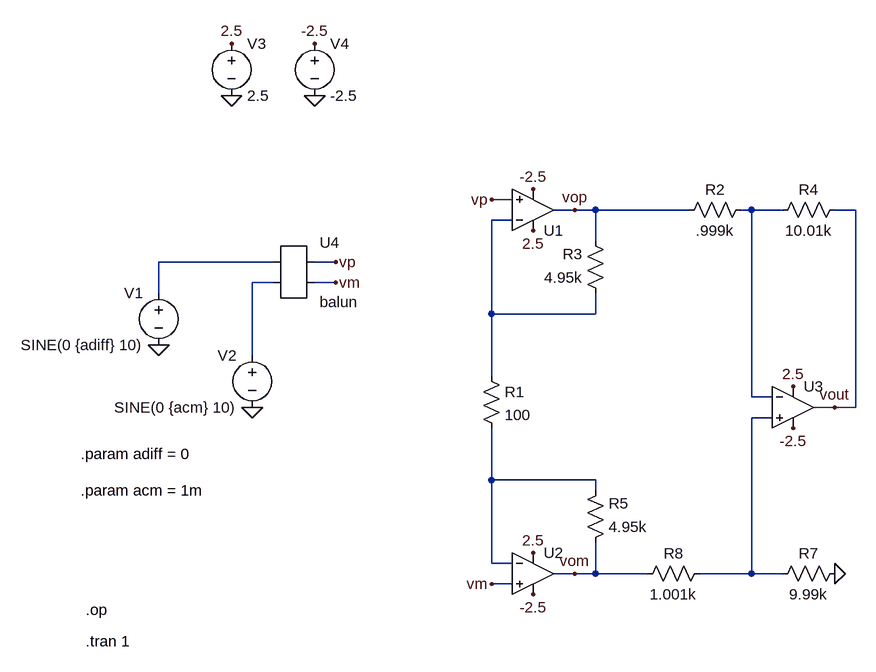
[diagram p0: schematic inamp_testbench.asc]
inamp_testbench.asc, the LTspice schematic file:
Version 4
SHEET 1 1708 880
WIRE 224 144 192 144
WIRE 320 160 288 160
WIRE 352 160 320 160
WIRE 496 160 352 160
WIRE 592 160 576 160
WIRE 640 160 592 160
WIRE 752 160 720 160
WIRE 224 176 192 176
WIRE 352 208 352 160
WIRE -144 240 -320 240
WIRE -48 240 -80 240
WIRE -144 272 -176 272
WIRE -48 272 -80 272
WIRE -320 288 -320 240
WIRE 192 320 192 176
WIRE 352 320 352 288
WIRE 352 320 192 320
WIRE -176 384 -176 272
WIRE 192 416 192 320
WIRE 592 448 592 160
WIRE 624 448 592 448
WIRE 720 464 688 464
WIRE 752 464 752 160
WIRE 752 464 720 464
WIRE 624 480 592 480
WIRE 192 576 192 496
WIRE 352 576 192 576
WIRE 352 592 352 576
WIRE 192 704 192 576
WIRE 224 704 192 704
WIRE 320 720 288 720
WIRE 352 720 352 672
WIRE 352 720 320 720
WIRE 432 720 352 720
WIRE 592 720 592 480
WIRE 592 720 512 720
WIRE 640 720 592 720
WIRE 224 736 192 736
FLAG -80 -16 0
FLAG -208 -16 0
FLAG -208 -96 2.5
FLAG -80 -96 -2.5
FLAG 256 192 2.5
FLAG 256 128 -2.5
FLAG 256 688 2.5
FLAG 256 752 -2.5
FLAG 320 160 vop
FLAG 320 720 vom
FLAG 720 720 0
FLAG 656 432 2.5
FLAG 656 496 -2.5
FLAG 720 464 vout
FLAG 192 144 vp
FLAG 192 736 vm
FLAG -320 368 0
FLAG -48 240 vp
FLAG -48 272 vm
FLAG -176 464 0
SYMBOL Opamps\\UniversalOpamp2 256 160 M180
SYMATTR InstName U1
SYMATTR SpiceModel level.1
SYMATTR Value2 Avol=10Meg GBW=1Meg Slew=10Meg
SYMBOL res 368 304 R180
WINDOW 0 36 76 Left 2
WINDOW 3 36 40 Left 2
SYMATTR InstName R3
SYMATTR Value 4.95k
SYMBOL voltage -208 -112 R0
WINDOW 123 24 44 Left 2
WINDOW 39 0 0 Left 0
SYMATTR InstName V3
SYMATTR Value 2.5
SYMBOL voltage -80 -112 R0
WINDOW 123 0 0 Left 0
WINDOW 39 0 0 Left 0
SYMATTR InstName V4
SYMATTR Value -2.5
SYMBOL Opamps\\UniversalOpamp2 256 720 R0
SYMATTR InstName U2
SYMATTR SpiceModel level.1
SYMATTR Value2 Avol=10Meg GBW=1Meg Slew=10Meg
SYMBOL res 336 688 M180
WINDOW 0 36 76 Left 2
WINDOW 3 36 40 Left 2
SYMATTR InstName R5
SYMATTR Value 4.95k
SYMBOL Opamps\\UniversalOpamp2 656 464 R0
SYMATTR InstName U3
SYMATTR SpiceModel level.1
SYMATTR Value2 Avol=10Meg GBW=1Meg Slew=10Meg
SYMBOL res 592 144 R90
WINDOW 0 0 56 VBottom 2
WINDOW 3 32 56 VTop 2
SYMATTR InstName R2
SYMATTR Value .999k
SYMBOL res 736 144 R90
WINDOW 0 0 56 VBottom 2
WINDOW 3 32 56 VTop 2
SYMATTR InstName R4
SYMATTR Value 10.01k
SYMBOL res 736 704 R90
WINDOW 0 0 56 VBottom 2
WINDOW 3 32 56 VTop 2
SYMATTR InstName R7
SYMATTR Value 9.99k
SYMBOL res 416 736 R270
WINDOW 0 32 56 VTop 2
WINDOW 3 0 56 VBottom 2
SYMATTR InstName R8
SYMATTR Value 1.001k
SYMBOL res 176 400 R0
SYMATTR InstName R1
SYMATTR Value 100
SYMBOL AutoGenerated\\balun -112 256 R0
SYMATTR InstName U4
SYMBOL voltage -320 272 M0
WINDOW 123 0 0 Left 0
WINDOW 39 0 0 Left 0
SYMATTR InstName V1
SYMATTR Value SINE(0 {adiff} 10)
SYMBOL voltage -176 368 M0
WINDOW 123 0 0 Left 0
WINDOW 39 0 0 Left 0
SYMATTR InstName V2
SYMATTR Value SINE(0 {acm} 10)
TEXT -432 776 Left 2 !.op
TEXT -432 824 Left 2 !.tran 1
TEXT -440 536 Left 2 !.param adiff = 0
TEXT -440 592 Left 2 !.param acm = 1m

The netlist it stands for:
* inamp_testbench.asc
XU1 vp N002 2.5 -2.5 vop level.1 Avol=10Meg GBW=1Meg Slew=10Meg ilimit=25m rail=0 Vos=0 phimargin=45 en=0 enk=0 in=0 ink=0 Rin=500Meg  ; pins IN+ IN- V+ V- OUT
R3 N002 vop 4.95k
V3 2.5 0 2.5
V4 -2.5 0 -2.5
XU2 vm N006 2.5 -2.5 vom level.1 Avol=10Meg GBW=1Meg Slew=10Meg ilimit=25m rail=0 Vos=0 phimargin=45 en=0 enk=0 in=0 ink=0 Rin=500Meg  ; pins IN+ IN- V+ V- OUT
R5 vom N006 4.95k
XU3 N005 N001 2.5 -2.5 vout level.1 Avol=10Meg GBW=1Meg Slew=10Meg ilimit=25m rail=0 Vos=0 phimargin=45 en=0 enk=0 in=0 ink=0 Rin=500Meg  ; pins IN+ IN- V+ V- OUT
R2 N001 vop .999k
R4 vout N001 10.01k
R7 0 N005 9.99k
R8 vom N005 1.001k
R1 N002 N006 100
* U4: balun (symbol AutoGenerated\balun not available, pins judged from their places): pin1=N003 pin2=N004 pin3=vp pin4=vm
V1 N003 0 SINE(0 {adiff} 10)
V2 N004 0 SINE(0 {acm} 10)
.op
.tran 1
.param adiff = 0
.param acm = 1m
.lib UniversalOpamps2.sub
.backanno
.end